# EAGLE design placa_sensores_eagle (EAGLE 9.1.3)
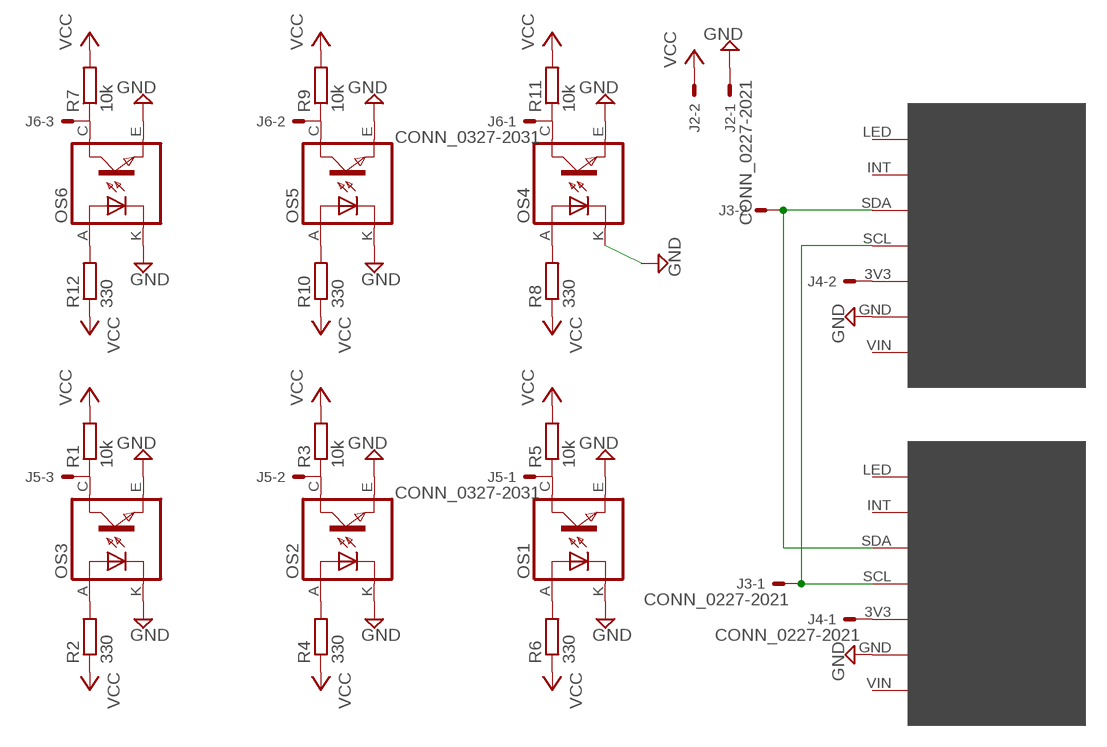
[diagram p0: schematic, sheet 1]

## Parts
J2  CONN_0227-2021  [6410-02]
J3  CONN_0227-2021  [6410-02]
J4  CONN_0227-2021  [6410-02]
J5  CONN_0327-2031  [6410-03]
J6  CONN_0327-2031  [6410-03]
OS1  TCRT5000  [TCRT5000]
OS2  TCRT5000  [TCRT5000]
OS3  TCRT5000  [TCRT5000]
OS4  TCRT5000  [TCRT5000]
OS5  TCRT5000  [TCRT5000]
OS6  TCRT5000  [TCRT5000]
R1  10k  R-EU_0204/7  [0204/7]
R2  330  R-EU_0204/7  [0204/7]
R3  10k  R-EU_0204/7  [0204/7]
R4  330  R-EU_0204/7  [0204/7]
R5  10k  R-EU_0204/7  [0204/7]
R6  330  R-EU_0204/7  [0204/7]
R7  10k  R-EU_0204/7  [0204/7]
R8  330  R-EU_0204/7  [0204/7]
R9  10k  R-EU_0204/7  [0204/7]
R10  330  R-EU_0204/7  [0204/7]
R11  10k  R-EU_0204/7  [0204/7]
R12  330  R-EU_0204/7  [0204/7]
TCS1  TCS34725  [TCS34725]
TCS2  TCS34725  [TCS34725]

## Nets
GND: J2.1 OS1.E(EMITTER) OS1.K(CATHODE) OS2.E(EMITTER) OS2.K(CATHODE) OS3.E(EMITTER) OS3.K(CATHODE) OS4.E(EMITTER) OS4.K(CATHODE) OS5.E(EMITTER) OS5.K(CATHODE) OS6.E(EMITTER) OS6.K(CATHODE) TCS1.GND TCS2.GND
N$1: J5.1 OS1.C(COLLECTOR) R5.1
N$2: OS5.A(ANODE) R10.2
N$3: J6.1 OS4.C(COLLECTOR) R11.1
N$4: J6.2 OS5.C(COLLECTOR) R9.1
N$5: J6.3 OS6.C(COLLECTOR) R7.1
N$6: OS6.A(ANODE) R12.2
N$7: J5.2 OS2.C(COLLECTOR) R3.1
N$8: J5.3 OS3.C(COLLECTOR) R1.1
N$9: OS1.A(ANODE) R6.2
N$10: OS2.A(ANODE) R4.2
N$11: OS3.A(ANODE) R2.2
N$12: J3.2 TCS1.SDA TCS2.SDA
N$13: J3.1 TCS1.SCL TCS2.SCL
N$14: J4.2 TCS1.3V3
N$15: J4.1 TCS2.3V3
N$16: OS4.A(ANODE) R8.2
VCC: J2.2 R1.2 R2.1 R3.2 R4.1 R5.2 R6.1 R7.2 R8.1 R9.2 R10.1 R11.2 R12.1
Unconnected: TCS1.INT TCS1.LED TCS1.VIN TCS2.INT TCS2.LED TCS2.VIN

## Library data of the parts
J2-J4 = Robotica-IFRN-SC-conectores:CONN_02: CONNECTOR wire to board 2.54 mm (.1 inch) pitch header; OC_FARNELL: unknown; OC_NEWARK: unknown
J5 J6 = Robotica-IFRN-SC-conectores:CONN_03: CONNECTOR wire to board 2.54 mm (.1 inch) pitch header; OC_FARNELL: unknown; OC_NEWARK: unknown
OS1-OS6 = Robotica-IFRN-SC-sensores:TCRT5000
R1-R12 = rcl:R-EU_: RESISTOR, European symbol; SPICEPREFIX: R
TCS1 TCS2 = Robotica-IFRN-SC-sensores:TCS34725: Sensor de cor TCS34725

## Board
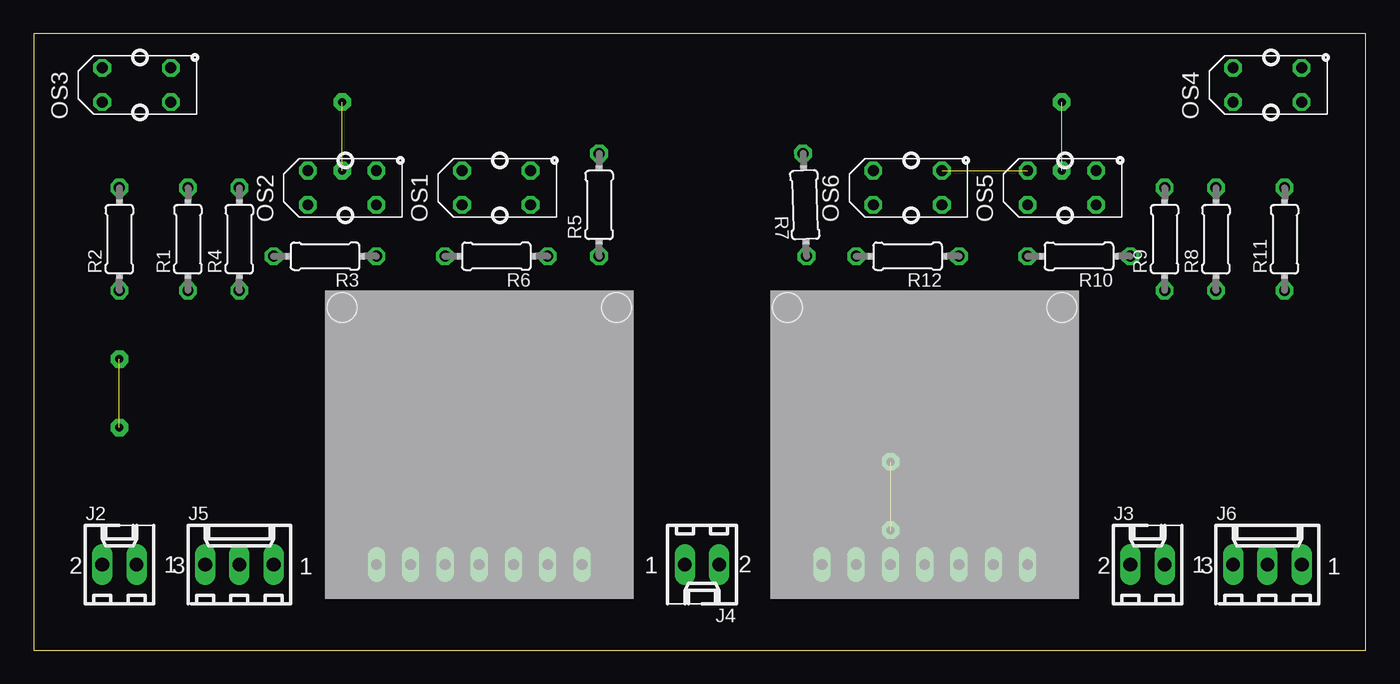
[diagram p1: board, top side]
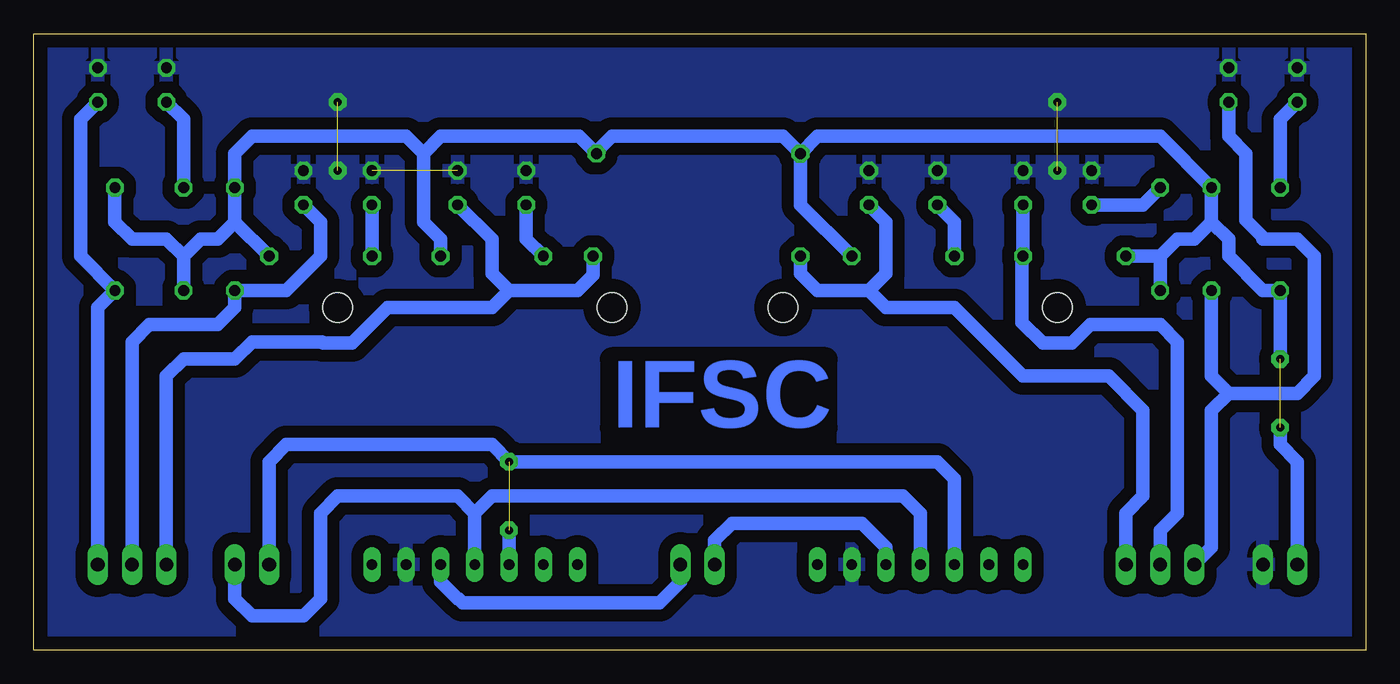
[diagram p2: board, bottom side, seen from below]

Size 98.73 x 45.71 mm. Coordinates in mm from the lower left corner, seen from the top.
Outline: 0,0 98.73,0 98.73,45.71 0,45.71 0,0
Copper layers (1*16): Top 0.035mm / dielectric 1.5mm / Bottom 0.035mm
Design rules "default *": minimum track width 40mil, minimum drill 0.35mm, track to track 35mil, track to pad 35mil, pad to pad 35mil, via to via 35mil, smd to smd 6mil, copper to edge 40mil, drill to drill 6mil, minimum pad ring 10mil, minimum via ring 8mil, stop-mask expansion 4mil, vias tented up to drill 0mil, thermal gap 15mil

### Footprints (pad centres in the part's own frame; a part is rotated, then mirrored left to right if it is on the bottom)
6410-02 = drill 1.016 long: 1 1.27,0; 2 -1.27,0
6410-03 = drill 1.016 long: 1 2.54,0; 2 0,0; 3 -2.54,0
TCRT5000 = drill 0.8 octagon: A -2.54,-1.27; C 2.54,-1.27; E 2.54,1.27; K -2.54,1.27
0204/7 = drill 0.813 octagon: 1 -3.81,0; 2 3.81,0
TCS34725 = drill 0.8 long: 3V3 0,-5.08; GND 2.54,-5.08; INT -7.62,-5.08; LED -10.16,-5.08; SCL -2.54,-5.08; SDA -5.08,-5.08; VIN 5.08,-5.08 | hole 2.2: -12.7,13.97; 7.62,13.97

### Placement (x,y rotation side)
J2  6.35,6.35 0 top
J3  82.55,6.35 0 top
J4  49.53,6.35 180 top
J5  15.24,6.35 0 top
J6  91.44,6.35 0 top
OS1  34.29,34.29 0 top
OS2  22.86,34.29 0 top
OS3  7.62,41.91 0 top
OS4  91.44,41.91 0 top
OS5  76.2,34.29 0 top
OS6  64.77,34.29 0 top
R1  11.43,30.48 90 top
R2  6.35,30.48 90 top
R3  21.59,29.21 180 top
R4  15.24,30.48 90 top
R5  41.91,33.02 90 top
R6  34.29,29.21 180 top
R7  57.15,33.02 91.9 top
R8  87.63,30.48 90 top
R9  83.82,30.48 90 top
R10  77.47,29.21 180 top
R11  92.71,30.48 90 top
R12  64.77,29.21 180 top
TCS1  68.58,11.43 0 top
TCS2  35.56,11.43 0 top

### Tracks (layer width: path | path; a pad name or v marks a point on that pad's centre or on a via)
GND  (via drill 0.6 pad 1.3)  (3 unrouted)
  other vias: 22.86,35.56 22.86,40.64 76.2,35.56 76.2,40.64
  pour Bottom: 0,45.72 0,0 99.06,0 99.06,45.72
N$1
  Bottom 1.016: OS1.C 35.56,31.75 35.56,27.94 36.83,26.67 | R5.1 41.91,27.94 40.64,26.67 36.83,26.67 | 36.83,26.67 35.56,25.4 30.48,25.4 25.4,20.32 19.05,20.32 16.51,17.78 16.51,11.43 17.78,10.16 J5.1
N$2
  Bottom 1.016: R10.2 73.66,30.48 OS5.A
N$3
  Bottom 1.016: OS4.C 95.25,39.37 95.25,29.21 R11.1 93.98,25.4 J6.1
N$4
  Bottom 1.016: OS5.C 77.47,31.75 77.47,29.21 80.01,26.67 R9.1 83.82,25.4 85.09,24.13 90.17,24.13 91.44,22.86 J6.2
N$5
  Bottom 1.016: R7.1 57.28,27.81 58.42,26.67 63.5,26.67 | 63.5,26.67 64.77,27.94 64.77,30.48 OS6.C | 63.5,26.67 64.77,25.4 72.49,25.4 75.11,22.78 77.29,22.78 77.37,22.86 82.55,22.86 83.82,21.59 87.63,21.59 88.9,20.32 J6.3
N$6
  Bottom 1.016: R12.2 62.23,30.48 OS6.A
N$7
  Bottom 1.016: OS2.C R3.1 25.48,29.13 25.48,24.31 23.95,22.78 21.77,22.78 20.42,24.13 15.24,24.13 13.97,22.86 13.97,10.16 15.24,8.89 J5.2
N$8
  Bottom 1.016: J5.3 11.43,7.62 11.43,17.78 10.16,19.05 | 10.16,19.05 11.43,20.32 R1.1 | OS3.C 10.16,38.1 8.89,36.83 8.89,31.9 7.62,30.63 | 7.62,30.63 7.62,30.48 | 7.62,30.63 7.47,30.48 5.08,30.48 3.81,29.21 3.81,20.32 5.08,19.05 10.16,19.05
N$9
  Bottom 1.016: R6.2 30.48,31.75 OS1.A
N$10
  Bottom 1.016: R4.2 16.51,33.02 OS2.A
N$11
  Bottom 1.016: R2.2 6.35,39.37 OS3.A
N$12  (via drill 0.6 pad 1.3)  (1 unrouted)
  Bottom 1.016: TCS2.SDA 30.48,12.7 31.75,13.97 v63.5,13.97 64.77,15.24 80.01,15.24 81.28,13.97 J3.2 | TCS1.SDA v63.5,8.89
N$13
  Bottom 1.016: TCS2.SCL 33.02,10.16 34.29,11.43 64.77,11.43 66.04,10.16 | 66.04,10.16 TCS1.SCL | 66.04,10.16 67.31,11.43 76.2,11.43 77.47,10.16 77.47,5.08 77.47,3.81 78.74,2.54 82.55,2.54 83.82,3.81 J3.1
N$14
  Bottom 1.016: J4.2 50.8,5.08 52.36,3.52 66.94,3.52 67.23,3.81 67.31,3.81 68.58,5.08 TCS1.3V3
N$15
  Bottom 1.016: TCS2.3V3 35.56,7.62 37.34,9.4 46.99,9.4 48.26,8.13 J4.1
N$16
  Bottom 1.016: R8.2 87.63,39.37 OS4.A
VCC  (via drill 0.6 pad 1.3)  (1 unrouted)
  Bottom 1.016: R4.1 15.24,29.21 | 15.24,29.21 13.97,30.48 12.7,30.48 11.43,31.75 | 11.43,31.75 R1.2 15.24,38.1 40.64,38.1 R5.2 | 11.43,31.75 10.16,30.48 10.16,29.21 7.62,26.67 R2.1 v6.35,21.59 | R5.2 41.91,33.02 R6.1 | R11.2 92.71,31.75 91.44,30.48 88.9,30.48 87.63,29.21 | R5.2 43.18,38.1 55.88,38.1 57.02,36.96 R7.2 58.3,38.1 68.58,38.1 69.85,36.83 | R12.1 68.58,30.48 69.85,31.75 69.85,36.83 | 69.85,36.83 71.12,38.1 82.55,38.1 83.82,36.83 R9.2 83.82,31.75 | R10.1 83.82,31.75 | 83.82,31.75 85.09,30.48 86.36,30.48 87.63,29.21 | 87.63,29.21 R8.1 | R3.2 15.24,29.21 | J2.2 5.08,13.97 6.35,15.24 v6.35,16.51

### Text on the board
Bottom: IFSC